# Altium schematic sheet Isolator.SchDoc
size A4 portrait; DocumentNumber: 1; SheetNumber: 4; SheetTotal: 5
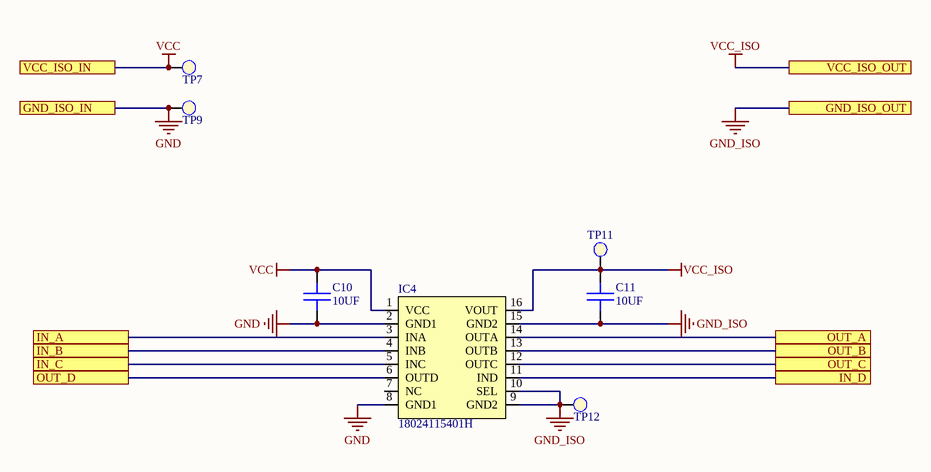
[diagram p0: Isolator.SchDoc]

## Parts
C10  10UF  [c1206]
C11  10UF  [c1206]
IC4  18024115401H  [WPME-CDIP_SOIC-16WB]
TP7  TestPoint1  [SMD_1mmPoint]  (value not drawn)  (no BOM)
TP9  TestPoint1  [SMD_1mmPoint]  (value not drawn)  (no BOM)
TP11  TestPoint1  [SMD_1mmPoint]  (value not drawn)  (no BOM)
TP12  TestPoint1  [SMD_1mmPoint]  (value not drawn)  (no BOM)

## Ports
GND_ISO_IN, GND_ISO_OUT, IN_A, IN_B, IN_C, IN_D, OUT_A, OUT_B, OUT_C, OUT_D, VCC_ISO_IN, VCC_ISO_OUT

## Nets
GND: C10.1 IC4.2(GND1) IC4.8(GND1) TP9.1 ; port GND_ISO_IN
GND_ISO: C11.1 IC4.9(GND2) IC4.10(SEL) IC4.15(GND2) TP12.1 ; port GND_ISO_OUT
VCC: C10.2 IC4.1(VCC) TP7.1 ; port VCC_ISO_IN
VCC_ISO: C11.2 IC4.16(VOUT) TP11.1 ; port VCC_ISO_OUT
IN_A: IC4.3(INA) ; port IN_A
IN_B: IC4.4(INB) ; port IN_B
IN_C: IC4.5(INC) ; port IN_C
IN_D: IC4.11(IND) ; port IN_D
OUT_A: IC4.14(OUTA) ; port OUT_A
OUT_B: IC4.13(OUTB) ; port OUT_B
OUT_C: IC4.12(OUTC) ; port OUT_C
OUT_D: IC4.6(OUTD) ; port OUT_D

Not connected (* = marked no-connect by the designer): IC4 7(NC)

## Notes on the sheet
- Tarih/Date
- Tasa/Desig
- Kont/Check
- Onay/Appr
- Sayfa/Sht
- Form
- Ortam/Env
- A4
- /
- Deg Tarihi/Chng Date
- Deg Onay/Chng Appr
- Rev
- (c) 2022 by SCSG Elektronik A.Ş.
  All rights Reserved. No part of this document may be produced or transmitted in any form or by any means electronic, mechanical, photocopying, recording, or otherwise, without prior written permission of SCSG.

## Library data of the parts
C10 C11 = CL31B106MOHNNNE: 10UF, 16V, X7R, 1206; Manufacturer: Samsung; Value: 10000000; Tolerance: 20%; Dielectric Material: Ceramic; Purpose Of Usage: ISOLATOR; Working Voltage: 0; Supplier 1: Digi-Key; Supplier Part Number 1: 1276-6641-1-ND; Manufacturer Part Number: CL31B106MOHNNNE; RoHS: YES; Mount: SMD; Case/Package: 1206; Case Code (Metric): 3216; Case Code (Imperial): 1206; Min Operating Temperature: -55°C; Max Operating Temperature: 125°C; Dielectric: X7R; Voltage Rating (DC): 16V; Voltage Rating: 16V; Category: CAPASITOR; Sub-Category: CERAMIC; Stock ID: ??; Local Supplier: GENERAL; Price 10K: 0.00250
IC4 = 18024115401H: WPME-CDIP Capacitive Digital Isolator Powered; Manufacturer: Wurth Elektronik; Manufacturer Part Number: 18024115401H; Category: INTEGRATED CIRCUITS; Max Operating Temperature: 125°C; Min Operating Temperature: -40°C; Case/Package: SOIC-16W; Lead Free: Lead Free; Mount: SMD; MSL: 1; Purpose Of Usage: ISOLATOR; RoHS: YES; Stock ID: ??; Sub-Category: ISOLATOR; Supplier 1: Digi-Key; Supplier Part Number 1: 732-18024115401HTR-ND
TP7 TP9 TP11 TP12 = TestPoint1: test ölçüm noktası; Manufacturer: NO BOM DEVICE; Purpose Of Usage: ISOLATOR; Category: CONNECTORS; Sub-Category: TEST POINT; Manufacturer Part Number: NO BOM DEVICE; Stock ID: ??